# EAGLE schematic controller (EAGLE 9.6.2)
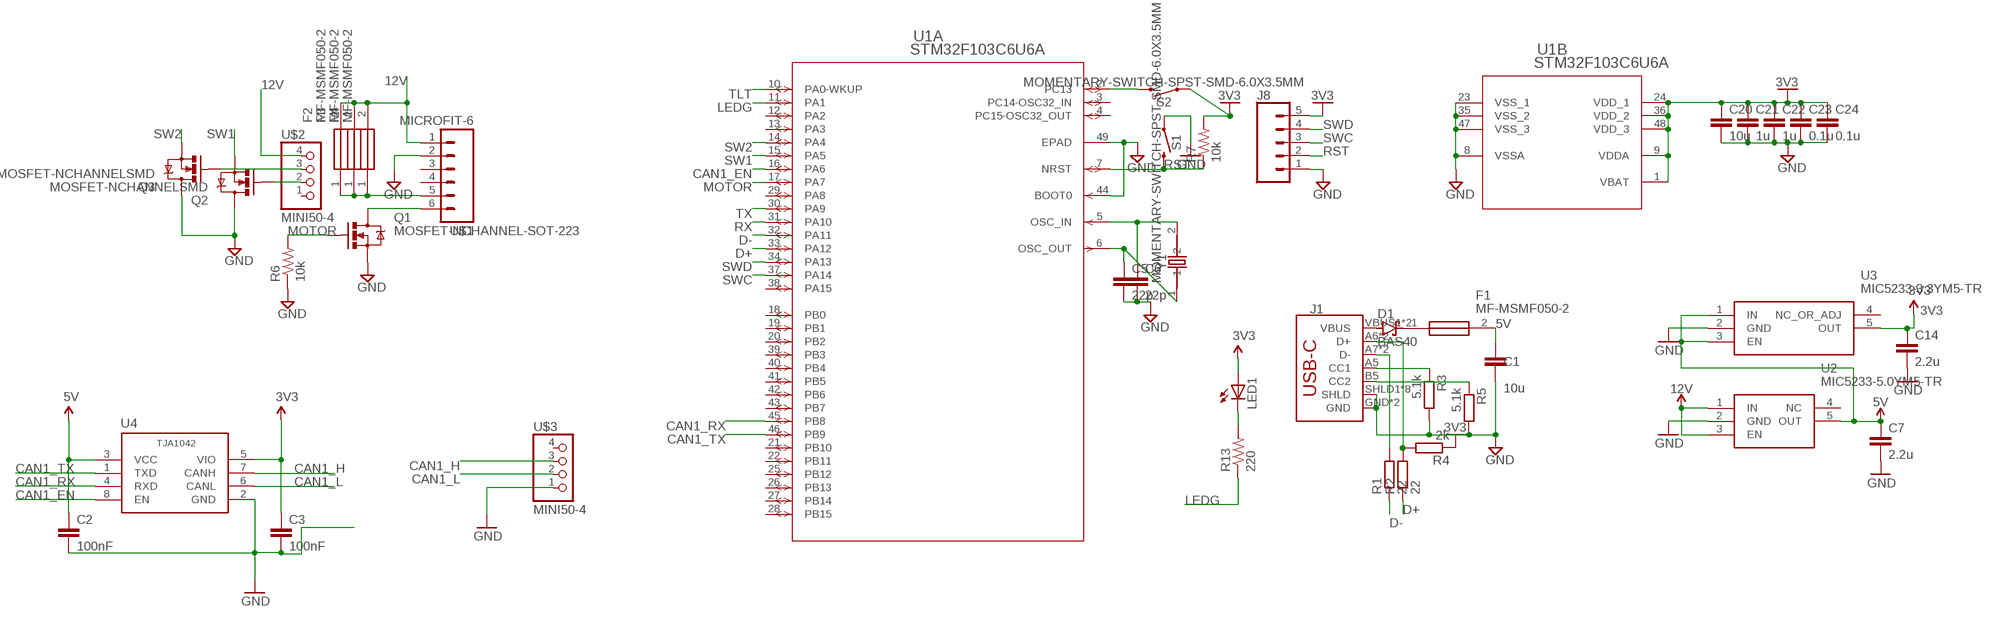
[diagram p0: schematic, sheet 1]

## Parts
C1  10u  C0603  [0603-C]
C2  100nF  C0603  [0603-C]
C3  100nF  C0603  [0603-C]
C5  22p  C-EUC1206  [C1206]
C6  22p  C-EUC1206  [C1206]
C7  2.2u  C-EUC0603  [C0603]
C14  2.2u  C-EUC0603  [C0603]
C20  10u  C-EUC1206  [C1206]
C21  1u  C-EUC1206  [C1206]
C22  1u  C-EUC1206  [C1206]
C23  0.1u  C-EUC1206  [C1206]
C24  0.1u  C-EUC1206  [C1206]
D1  BAS40  [SOT23]
F1  MF-MSMF050-2  [FUSC4632X85N]
F2  MF-MSMF050-2  [FUSC4632X85N]
F3  MF-MSMF050-2  [FUSC4632X85N]
F4  MF-MSMF050-2  [FUSC4632X85N]
J1  SPARKFUN-CONNECTORS_USB_C16PIN  [SPARKFUN-CONNECTORS_USB-C-16P]
J8  CONN_051.27MM  [1X05_1.27MM]
LED1  LEDCHIPLED_0805  [CHIPLED_0805]
Q1  MOSFET-NCHANNEL-SOT-223  [SOT-223]
Q2  MOSFET-NCHANNELSMD  [SOT23-3]
Q3  MOSFET-NCHANNELSMD  [SOT23-3]
R1  22  R-EU_R1206  [R1206]
R2  22  R-EU_R1206  [R1206]
R3  5.1k  R-EU_R1206  [R1206]
R4  2k  R-EU_R1206  [R1206]
R5  5.1k  R-EU_R1206  [R1206]
R6  10k  R0402  [0402-R]
R7  10k  R0402  [0402-R]
R13  220  R0402  [0402-R]
S1  MOMENTARY-SWITCH-SPST-SMD-6.0X3.5MM  [TACTILE_SWITCH_SMD_6.0X3.5MM]
S2  MOMENTARY-SWITCH-SPST-SMD-6.0X3.5MM  [TACTILE_SWITCH_SMD_6.0X3.5MM]
U1  STM32F103C6U6A  [UFQFPN-48_7X7X0P55MM]
U2  MIC5233-5.0YM5-TR  [SOT95P280X145-5N]
U3  MIC5233-3.3YM5-TR  [SOT95P280X145-5N]
U4  TJA1042  [NXP_SEMICONDUCTORS_TJA1042T-3-CM_118_0]
U$1  MICROFIT-6  [MICROFIT-6]
U$2  MINI50-4  [MINI50]
U$3  MINI50-4  [MINI50]
Y1  8MHz  5032/2P  [OSCCC500X320X135]

## Nets
3V3: C3.1 C14.1 C20.1 C21.1 C22.1 C23.1 C24.1 J8.5 LED1.A R4.1 R7.2 S2.1 U1.1(B:VBAT) U1.9(B:VDDA) U1.24(B:VDD_1) U1.36(B:VDD_2) U1.48(B:VDD_3) U3.5(OUT) U4.5(VIO)
5V: C1.1 C2.1 C7.1 F1.2 U2.5(OUT) U3.1(IN) U3.3(EN) U4.3(VCC)
12V: F2.2 F3.2 F4.2 U2.1(IN) U2.3(EN) U$1.1 U$2.4
CAN1_EN: U1.16(A:PA6) U4.8(EN)
CAN1_H: U4.7(CANH) U$3.3
CAN1_L: U4.6(CANL) U$3.2
CAN1_RX: U1.45(A:PB8) U4.4(RXD)
CAN1_TX: U1.46(A:PB9) U4.1(TXD)
D+: R2.1 U1.33(A:PA12)
D-: R1.1 U1.32(A:PA11)
GND: C1.2 C2.2 C3.2 C5.2 C6.2 C7.2 C14.2 C20.2 C21.2 C22.2 C23.2 C24.2 J1.GND J1.GND2(GND) J1.SHLD1(SHLD) J1.SHLD2(SHLD) J1.SHLD3(SHLD) J1.SHLD4(SHLD) J1.SHLD5(SHLD) J1.SHLD6(SHLD) J1.SHLD7(SHLD) J1.SHLD8(SHLD) J8.1 Q1.3(S) Q2.3(D) Q3.3(D) R3.2 R5.2 R6.1 S1.1 U1.8(B:VSSA) U1.23(B:VSS_1) U1.35(B:VSS_2) U1.44(A:BOOT0) U1.47(B:VSS_3) U1.49(A:EPAD) U2.2(GND) U3.2(GND) U4.2(GND) U$1.2 U$3.1
LEDG: R13.1 U1.11(A:PA1)
MOTOR: Q1.1(G) R6.2 U1.17(A:PA7)
N$1: S2.2 U1.2(A:PC13)
N$2: Q2.1(G) U$2.2
N$4: F2.1 F3.1 F4.1 U$1.5
N$5: Q3.1(G) U$2.3
N$6: Q1.2(D) Q1.4(D) U$1.6
N$7: D1.1(A) J1.VBUS1(VBUS) J1.VBUS2(VBUS)
N$8: D1.3(C) F1.1
N$10: C6.1 U1.5(A:OSC_IN) Y1.2
N$12: C5.1 U1.6(A:OSC_OUT) Y1.1
N$13: J1.A5(CC1) R3.1
N$14: J1.B5(CC2) R5.1
N$18: J1.A7(D-) J1.B7(D-) R1.2
N$19: J1.A6(D+) J1.B6(D+) R2.2 R4.2
N$26: LED1.C R13.2
RST: J8.2 R7.1 S1.2 U1.7(A:NRST)
RX: U1.31(A:PA10)
SW1: Q2.2(S) U1.15(A:PA5)
SW2: Q3.2(S) U1.14(A:PA4)
SWC: J8.3 U1.37(A:PA14)
SWD: J8.4 U1.34(A:PA13)
TLT: U1.10(A:PA0-WKUP)
TX: U1.30(A:PA9)
Unconnected: U1.3(A:PC14-OSC32_IN) U1.4(A:PC15-OSC32_OUT) U1.12(A:PA2) U1.13(A:PA3) U1.18(A:PB0) U1.19(A:PB1) U1.20(A:PB2) U1.21(A:PB10) U1.22(A:PB11) U1.25(A:PB12) U1.26(A:PB13) U1.27(A:PB14) U1.28(A:PB15) U1.29(A:PA8) U1.38(A:PA15) U1.39(A:PB3) U1.40(A:PB4) U1.41(A:PB5) U1.42(A:PB6) U1.43(A:PB7) U2.4(NC) U3.4(NC_OR_ADJ) U$1.3 U$1.4 U$2.1 U$3.4

## Library data of the parts
C1-C3 = comma.ai:C
C5 C6 C20-C24 = resistor:C-EU: CAPACITOR, European symbol
C7 C14 = rcl:C-EU: CAPACITOR, European symbol; SPICEPREFIX: C
D1 = diode:BAS40: Silicon Schottky Diodes General-purpose diode for high-speed switching
F1-F4 = SamacSys_Parts:MF-MSMF050-2: Fuse, PTC, Resettable, SMD, 1812, 500mA Bourns 0.5A Surface Mount Resettable Fuse, 15 V Source: Datasheet <http://uk.rs-online.com/web/p/products/6478156P>; ALLIED_NUMBER: 70153466; DESCRIPTION: Fuse, PTC, Resettable, SMD, 1812, 500mA Bourns 0.5A Surface Mount Resettable Fuse, 15 V; HEIGHT: 0.85mm; MANUFACTURER_NAME: Bourns; MANUFACTURER_PART_NUMBER: MF-MSMF050-2; RS_PART_NUMBER: 6478156P; RS_PRICE-STOCK: http://uk.rs-online.com/web/p/products/6478156P
J1 = USB-C-Breakout:SPARKFUN-CONNECTORS_USB_C: USB Type C 16Pin Connector Super Speed pins not available on the 16-pin purely SMD connector so this part is best for USB 2.0 implementations. D1 and D2 are tied together enabling D+/- no matter which way the cable is plugged into the connector. The two channel configuration pins (CC1/2) are exposed. These are normally connected to ground via 5.1k resistors but can be reconfigured for high current/high power applications.; PROD_ID: CONN-14122
J8 = SparkFun-Connectors:CONN_05: Multi connection point. Often used as Generic Header-pin footprint for 0.1 inch spaced/style header connections On any of the 0.1 inch spaced packages, you can populate with these: Break Away Headers - Straight <https://www.sparkfun.com/products/116> (PRT-00116) Break Away Male Headers - Right Angle <https://www.sparkfun.com/products/553> (PRT-00553) Female Headers <https://www.sparkfun.com/products/115> (PRT-00115) Break Away Headers - Machine Pin <https://www.sparkfun.com/products/117> (PRT-00117) Break Away Female Headers - Swiss Machine Pin <https://www.sparkfun.com/products/743> (PRT-00743) For SCREWTERMINALS and SPRING TERMINALS visit here: Screw Terimnals on SparkFun.com <https://www.sparkfun.com/search/results?term=Screw+Terminals> (5mm/3.5mm/2.54mm spacing) This device is also useful as a general connection point to wire up your design to another part of your project. Our various solder wires solder well into these plated through hole pads. Hook-Up Wire - Assortment (Stranded, 22 AWG) <https://www.sparkfun.com/products/11375> (PRT-11375) Hook-Up Wire - Assortment (Solid Core, 22 AWG) <https://www.sparkfun.com/products/11367> (PRT-11367) View the entire wire category on our website here <https://www.sparkfun.com/categories/141> Special notes: Molex polarized connector foot print use with SKU : PRT-08231 with associated crimp pins and housings. 1MM SMD Version SKU: PRT-10208
LED1 = adafruit:LED: LED OSRAM: - CHIPLED LG R971, LG N971, LY N971, LG Q971, LY Q971, LO R971, LY R971 LH N974, LH R974 LS Q976, LO Q976, LY Q976 LO Q996 - Hyper CHIPLED LW Q18S LB Q993, LB Q99A, LB R99A - SideLED LS A670, LO A670, LY A670, LG A670, LP A670 LB A673, LV A673, LT A673, LW A673 LH A674 LY A675 LS A676, LA A676, LO A676, LY A676, LW A676 LS A679, LY A679, LG A679 - Hyper Micro SIDELED® LS Y876, LA Y876, LO Y876, LY Y876 LT Y87S - SmartLED LW L88C, LW L88S LB L89C, LB L89S, LG L890 LS L89K, LO L89K, LY L89K LS L896, LA L896, LO L896, LY L896 - TOPLED LS T670, LO T670, LY T670, LG T670, LP T670 LSG T670, LSP T670, LSY T670, LOP T670, LYG T670 LG T671, LOG T671, LSG T671 LB T673, LV T673, LT T673, LW T673 LH T674 LS T676, LA T676, LO T676, LY T676, LB T676, LH T676, LSB T676, LW T676 LB T67C, LV T67C, LT T67C, LS T67K, LO T67K, LY T67K, LW E67C LS E67B, LA E67B, LO E67B, LY E67B, LB E67C, LV E67C, LT E67C LW T67C LS T679, LY T679, LG T679 LS T770, LO T770, LY T770, LG T770, LP T770 LB T773, LV T773, LT T773, LW T773 LH T774 LS E675, LA E675, LY E675, LS T675 LS T776, LA T776, LO T776, LY T776, LB T776 LHGB T686 LT T68C, LB T68C - Hyper Mini TOPLED® LB M676 - Mini TOPLED Santana® LG M470 LS M47K, LO M47K, LY M47K Source: http://www.osram.convergy.de/
Q1-Q3 = fets:MOSFET-NCHANNEL: Generic NMOS footprint
R1 R2 = rcl:R-EU_: RESISTOR, European symbol; SPICEPREFIX: R
R3-R5 = resistor:R-EU_: RESISTOR, European symbol
R6 R7 R13 = comma.ai:R
S1 S2 = SparkFun-Switches:MOMENTARY-SWITCH-SPST: Momentary Switch (Pushbutton) - SPST Normally-open (NO) SPST momentary switches (buttons, pushbuttons). Variants PTH-12MM - 12mm square, through-hole Momentary Pushbutton Switch - 12mm Square <https://www.sparkfun.com/products/9190> (COM-09190) PTH-6.0MM, PTH-6.0MM-KIT - 6.0mm square, through-hole Mini Pushbutton Switch <https://www.sparkfun.com/products/97> (COM-00097) KIT package intended for soldering kit's - only one side of pads' copper is exposed. PTH-RIGHT-ANGLE-KIT - Right-angle, through-hole Right Angle Tactile Button <https://www.sparkfun.com/products/10791> - Used on SparkFun BigTime Watch Kit <https://www.sparkfun.com/products/11734> SMD-12MM - 12mm square, surface-mount Tactile Button - SMD (12mm) <https://www.sparkfun.com/products/12993> (COM-12993) Used on SparkFun PicoBoard <https://www.sparkfun.com/products/11888> SMD-4.5MM - 4.5mm Square Trackball Switch Used on SparkFun Blackberry Trackballer Breakout <https://www.sparkfun.com/products/13169> SMD-4.6MMX2.8MM - 4.60mm x 2.80mm, surface mount Used on SparkFun SAMD21 Mini Breakout <https://www.sparkfun.com/products/13664> SMD-5.2MM, SMD-5.2-REDUNDANT - 5.2mm square, surface-mount Mini Pushbutton Switch - SMD <https://www.sparkfun.com/products/8720> (COM-08720) Used on Arduino Pro Mini <https://www.sparkfun.com/products/11114> REDUNDANT package connects both switch circuits together SMD-6.0X3.5MM - 6.0 x 3.5mm, surface mount Momentary Reset Switch SMD <https://www.sparkfun.com/products/8229> (COM-08229) SMD-6.2MM-TALL - 6.2mm square, surface mount Tactile Button - SMD (6mm) <https://www.sparkfun.com/products/12992> Used on SparkFun Digital Sandbox <https://www.sparkfun.com/products/12651> SMD-RIGHT-ANGLE - Right-angle, surface mount Used on SparkFun Block for Intel® Edison - Arduino <https://www.sparkfun.com/products/13036>; PROD_ID: SWCH-00815; SF_SKU: COM-08229
U1 = STMicroelectronics - STM32F303CCT6:STM32F103C6U6A; COPYRIGHT: Copyright (C) 2018 Accelerated Designs. All rights reserved; MANUFACTURER_PART_NUMBER: STM32F103C6U6A; SOURCELIBRARY: STMicroelectronics_2020-10-07; VENDOR: STMicroelectronics
U2 = SamacSys_Parts:MIC5233-5.0YM5-TR: MICROCHIP - MIC5233-5.0YM5-TR - LDO, REG, 36VIN, 0.1A, 5V, 2%, 5SOT23 Source: Datasheet <https://componentsearchengine.com/Datasheets/2/MIC5233-5.0YM5-TR.pdf>; DESCRIPTION: MICROCHIP - MIC5233-5.0YM5-TR - LDO, REG, 36VIN, 0.1A, 5V, 2%, 5SOT23; HEIGHT: 1.45mm; MANUFACTURER_NAME: Microchip; MANUFACTURER_PART_NUMBER: MIC5233-5.0YM5-TR; MOUSER_PART_NUMBER: 998-MIC5233-5.0YM5TR; MOUSER_PRICE-STOCK: https://www.mouser.co.uk/ProductDetail/Microchip-Technology-Micrel/MIC5233-50YM5-TR?qs=U6T8BxXiZAWSnpCHgrMajw%3D%3D
U3 = SamacSys_Parts:MIC5233-3.3YM5-TR: High Input Voltage Low IQ UCAP LDO Regulator Source: Datasheet <http://ww1.microchip.com/downloads/en/DeviceDoc/MIC5233-Data-Sheet-DS20006033D.pdf>; DESCRIPTION: High Input Voltage Low IQ UCAP LDO Regulator; HEIGHT: 1.45mm; MANUFACTURER_NAME: Microchip; MANUFACTURER_PART_NUMBER: MIC5233-3.3YM5-TR; MOUSER_PART_NUMBER: 998-MIC5233-3.3YM5TR; MOUSER_PRICE-STOCK: https://www.mouser.co.uk/ProductDetail/Microchip-Technology-Micrel/MIC5233-33YM5-TR?qs=U6T8BxXiZAWDhshLMgpaLQ%3D%3D
U4 = CM,118:TJA1042
U$1 = interceptor:MICROFIT-6
U$2 U$3 = interceptor:MINI50-4
Y1 = 5032_2P:5032/2P: SMD Crystal 12Mhz-20pF-20ppm-40R;; AVAILABILITY: Unavailable; DESCRIPTION: Amphenol; MF: Shenzen jingpenyuan Co. LTD; MP: 5032/2P; PACKAGE: None; PRICE: None